# Altium schematic sheet Resolver.SchDoc
size A4
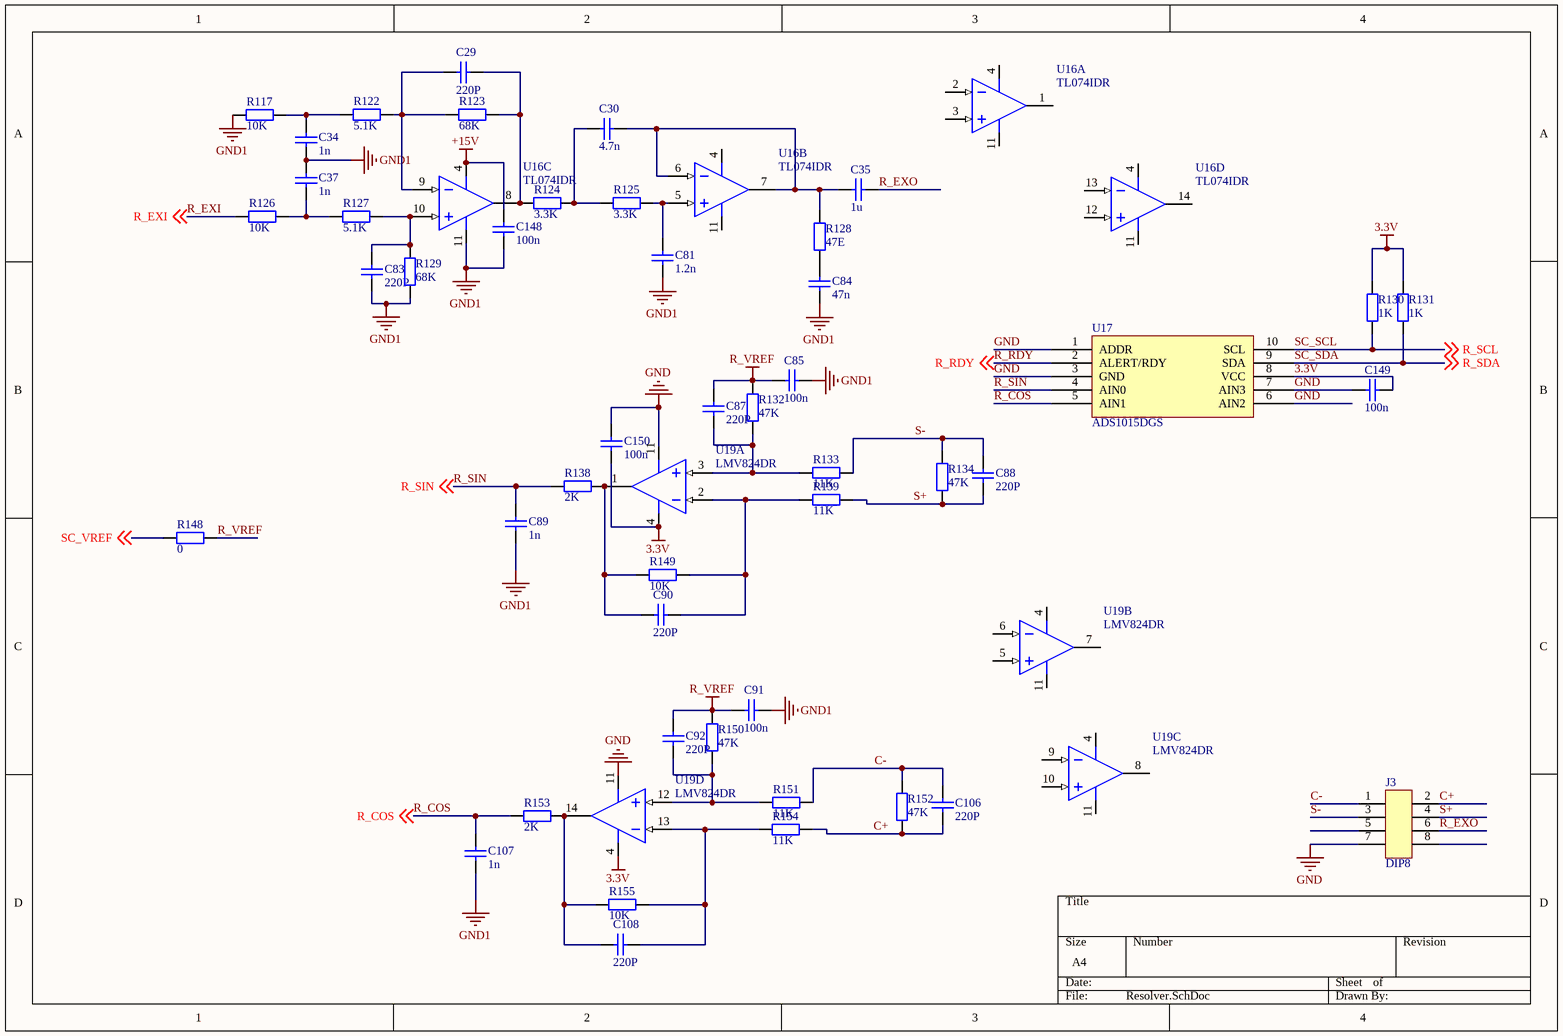
[diagram p0: Resolver.SchDoc]

## Parts
C29  220P  [0603C]
C30  4.7n  [0603C]
C34  1n  [0603C]
C35  1u  [0603C]
C37  1n  [0603C]
C81  1.2n  [0603C]
C83  220P  [0603C]
C84  47n  [0603C]
C85  100n  [0603C]
C87  220P  [0603C]
C88  220P  [0603C]
C89  1n  [0603C]
C90  220P  [0603C]
C91  100n  [0603C]
C92  220P  [0603C]
C106  220P  [0603C]
C107  1n  [0603C]
C108  220P  [0603C]
C148  100n  [0603C]
C149  100n  [0603C]
C150  100n  [0603C]
J3  DIP8  [DIP8-2.54]
R117  10K  [0603R]
R122  5.1K  [0603R]
R123  68K  [0603R]
R124  3.3K  [0603R]
R125  3.3K  [0603R]
R126  10K  [0603R]
R127  5.1K  [0603R]
R128  47E  [0603R]
R129  68K  [0603R]
R130  1K  [0603R]
R131  1K  [0603R]
R132  47K  [0603R]
R133  11K  [0603R]
R134  47K  [0603R]
R138  2K  [0603R]
R139  11K  [0603R]
R148  0  [0603R]
R149  10K  [0603R]
R150  47K  [0603R]
R151  11K  [0603R]
R152  47K  [0603R]
R153  2K  [0603R]
R154  11K  [0603R]
R155  10K  [0603R]
U16  TL074IDR  [SOP-14]  (parts A,B,C,D of 4)
U17  ADS1015DGS  [VSSOP-10]
U19  LMV824DR  [SOP-14]  (parts A,B,C,D of 4)

## Nets
3.3V: C149.2 C150.1 R130.1 R131.1 U17.8(VCC) U19.4(GND)
+15V: C148.2 U16.4(GND)
GND: C149.1 C150.2 J3.7 U17.1(ADDR) U17.3(GND) U17.6(AIN2) U17.7(AIN3) U19.11(V+)
GND1: C34.1 C37.2 C81.1 C83.1 C84.1 C85.1 C89.1 C91.1 C107.1 C148.1 R117.2 R129.2 U16.11(V+)
R_VREF: C85.2 C87.2 C91.2 C92.2 R132.1 R148.1 R150.1
C+: C106.2 J3.2 R152.2 R154.1
C-: C106.1 J3.1 R151.1 R152.1
R_COS: C107.2 R153.1 U17.5(AIN1) ; off-sheet R_COS
R_EXI: R126.2 ; off-sheet R_EXI
R_EXO: C35.2 J3.6
R_RDY: U17.2(ALERT/RDY) ; off-sheet R_RDY
R_SIN: C89.2 R138.1 U17.4(AIN0) ; off-sheet R_SIN
S+: C88.2 J3.4 R134.2 R139.1
S-: C88.1 J3.3 R133.1 R134.1
SC_SCL: R130.2 U17.10(SCL) ; off-sheet R_SCL  [also labelled R_SCL]
SC_SDA: R131.2 U17.9(SDA) ; off-sheet R_SDA  [also labelled R_SDA]
SC_VREF: R148.2 ; off-sheet SC_VREF
NetC29_1: C29.1 R122.1 R123.2 U16.9(IN-)
NetC29_2: C29.2 R123.1 R124.2 U16.8(OUT)
NetC30_1: C30.1 R124.1 R125.2
NetC30_2: C30.2 C35.1 R128.1 U16.6(IN-) U16.7(OUT2)
NetC34_2: C34.2 R117.1 R122.2
NetC37_1: C37.1 R126.1 R127.2
NetC81_2: C81.2 R125.1 U16.5(IN+)
NetC83_2: C83.2 R127.1 R129.1 U16.10(IN+)
NetC84_2: C84.2 R128.2
NetC87_1: C87.1 R132.2 R133.2 U19.3(IN+)
NetC90_1: C90.1 R138.2 R149.1 U19.1(OUT)
NetC90_2: C90.2 R139.2 R149.2 U19.2(IN-)
NetC92_1: C92.1 R150.2 R151.2 U19.12(IN+)
NetC108_1: C108.1 R153.2 R155.1 U19.14(OUT)
NetC108_2: C108.2 R154.2 R155.2 U19.13(IN-)

Not connected (* = marked no-connect by the designer): J3 5 8; U16 1(OUT) 2(IN-) 3(IN+) 12(IN+) 13(IN-) 14(OUT); U19 5(IN+) 6(IN-) 7(OUT2) 8(OUT) 9(IN-) 10(IN+)

## Library data of the parts
C29 C30 C34 C35 C37 C81 C83-C85 C87-C92 C106-C108 C148-C150 = Cap: Capacitor; Value: 100pF; Published: 8-Jun-2000; LatestRevisionDate: 17-Jul-2002; LatestRevisionNote: Re-released for DXP Platform.; PackageReference: RAD-0.3; Publisher: Altium Limited
J3 = DIP8: Connectors; Set Position: 0.5; Published: 8-Jun-2000; LatestRevisionDate: 17-Jul-2002; LatestRevisionNote: Re-released for DXP Platform.; PackageReference: AXIAL-0.6; Publisher: Altium Limited
R117 R122-R129 R132-R134 R138 R139 R148-R155 = Res2: Resistor; Value: 1K; Published: 8-Jun-2000; LatestRevisionDate: 17-Jul-2002; LatestRevisionNote: Re-released for DXP Platform.; PackageReference: AXIAL-0.4; Publisher: Altium Limited
R130 R131 = Res2: Resistor; Published: 8-Jun-2000; LatestRevisionDate: 17-Jul-2002; LatestRevisionNote: Re-released for DXP Platform.; PackageReference: AXIAL-0.4; Publisher: Altium Limited; Value: 1K
U16 U19 = LM339AD: Quad Single-Supply Comparator; Published: 17-Jul-2002; LatestRevisionDate: 13-Apr-2006; LatestRevisionNote: IPC-7351 Footprint Added.; DatasheetVersion: 1988; PackageVersion: 1991; PackageReference: 751A-02; Publisher: Altium Limited; PackageDescription: 14-Pin Small Outline Integrated Circuit 1.27 mm Pitch; Code_IPC: SOIC127P600-14; ComponentLink1Description: Manufacturer Link; ComponentLink1URL: http://www.onsemi.com/site/products/taxonomy/0,4438,133,00.html
U17 = ADS1015